# EAGLE design coaster-beer-art2_con_v.2 (EAGLE 5.04)
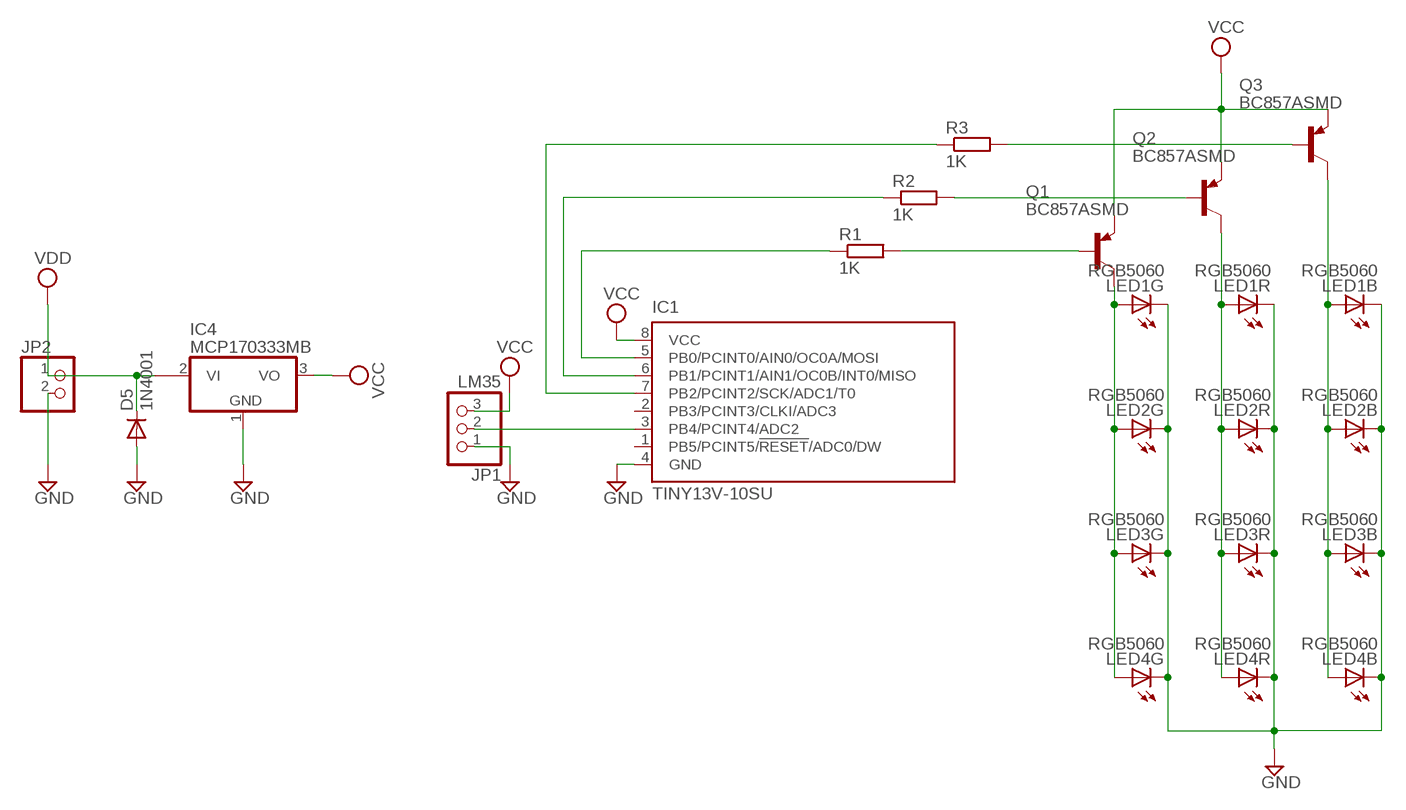
[diagram p0: schematic, sheet 1]

## Parts
D5  1N4001  DIODE-MELF-MLL41  [MELF-MLL41]
IC1  TINY13V-10SU  [8S2]
IC4  MCP170333MB  [SOT89]
JP1  LM35  PINHD-1X3  [1X03]
JP2  PINHD-1X2  [1X02]
LED1  RGB5060  LP2C63-ST-RGB-SR0  [LP2C63-ST-RGB-SR0]
LED2  RGB5060  LP2C63-ST-RGB-SR0  [LP2C63-ST-RGB-SR0]
LED3  RGB5060  LP2C63-ST-RGB-SR0  [LP2C63-ST-RGB-SR0]
LED4  RGB5060  LP2C63-ST-RGB-SR0  [LP2C63-ST-RGB-SR0]
Q1  BC857ASMD  [SOT23-BEC]
Q2  BC857ASMD  [SOT23-BEC]
Q3  BC857ASMD  [SOT23-BEC]
R1  1K  R-EU_R0805  [R0805]
R2  1K  R-EU_R0805  [R0805]
R3  1K  R-EU_M0805  [M0805]

## Nets
GND: D5.A IC1.4(GND) IC4.1(GND) JP1.1 JP2.2 LED1.4(B:C) LED1.5(R:C) LED1.6(G:C) LED2.4(B:C) LED2.5(R:C) LED2.6(G:C) LED3.4(B:C) LED3.5(R:C) LED3.6(G:C) LED4.4(B:C) LED4.5(R:C) LED4.6(G:C)
N$2: IC1.3(PB4/PCINT4/ADC2) JP1.2
N$5: LED1.1(G:A) LED2.1(G:A) LED3.1(G:A) LED4.1(G:A) Q1.C
N$6: LED1.2(R:A) LED2.2(R:A) LED3.2(R:A) LED4.2(R:A) Q2.C
N$8: IC1.5(PB0/PCINT0/AIN0/OC0A/MOSI) R1.1
N$9: Q3.B R3.2
N$10: Q2.B R2.2
N$11: Q1.B R1.2
N$13: IC1.6(PB1/PCINT1/AIN1/OC0B/INT0/MISO) R2.1
N$14: IC1.7(PB2/PCINT2/SCK/ADC1/T0) R3.1
N$15: LED1.3(B:A) LED2.3(B:A) LED3.3(B:A) LED4.3(B:A) Q3.C
VCC: IC1.8(VCC) IC4.3(VO) JP1.3 Q1.E Q2.E Q3.E
VDD: D5.C IC4.2@1(VI1) JP2.1
Unconnected: IC1.1(PB5/PCINT5/!RESET!/ADC0/DW) IC1.2(PB3/PCINT3/CLKI/ADC3) IC4.2(VI)

## Library data of the parts
D5 = diode:DIODE-: DIODE
IC1 = atmel:TINY13: 8-bit AVR Microcontroller with 1K Bytes In-System Programmable Flash Source: http://www.atmel.com/dyn/resources/prod_documents/2535S.pdf
IC4 = linear:MCP1703*: 250 mA, 16V, Low Quiescent Current LDO Regulator Source: http://ww1.microchip.com/downloads/en/DeviceDoc/22049b.pdf
JP1 = pinhead:PINHD-1X3: PIN HEADER
JP2 = pinhead:PINHD-1X2: PIN HEADER
LED1-LED4 = led-test-chuja:LP2C63-ST-RGB-SR0: 1.5W RGB HIGH POWER LED Source: http://www.ledtech.com.tw .. LP2C63-ST-RGB-SR0.SPEC.pdf
Q1-Q3 = transistor-pnp:BC857*: PNP Transistror
R1-R3 = rcl:R-EU_: RESISTOR, European symbol

## Board
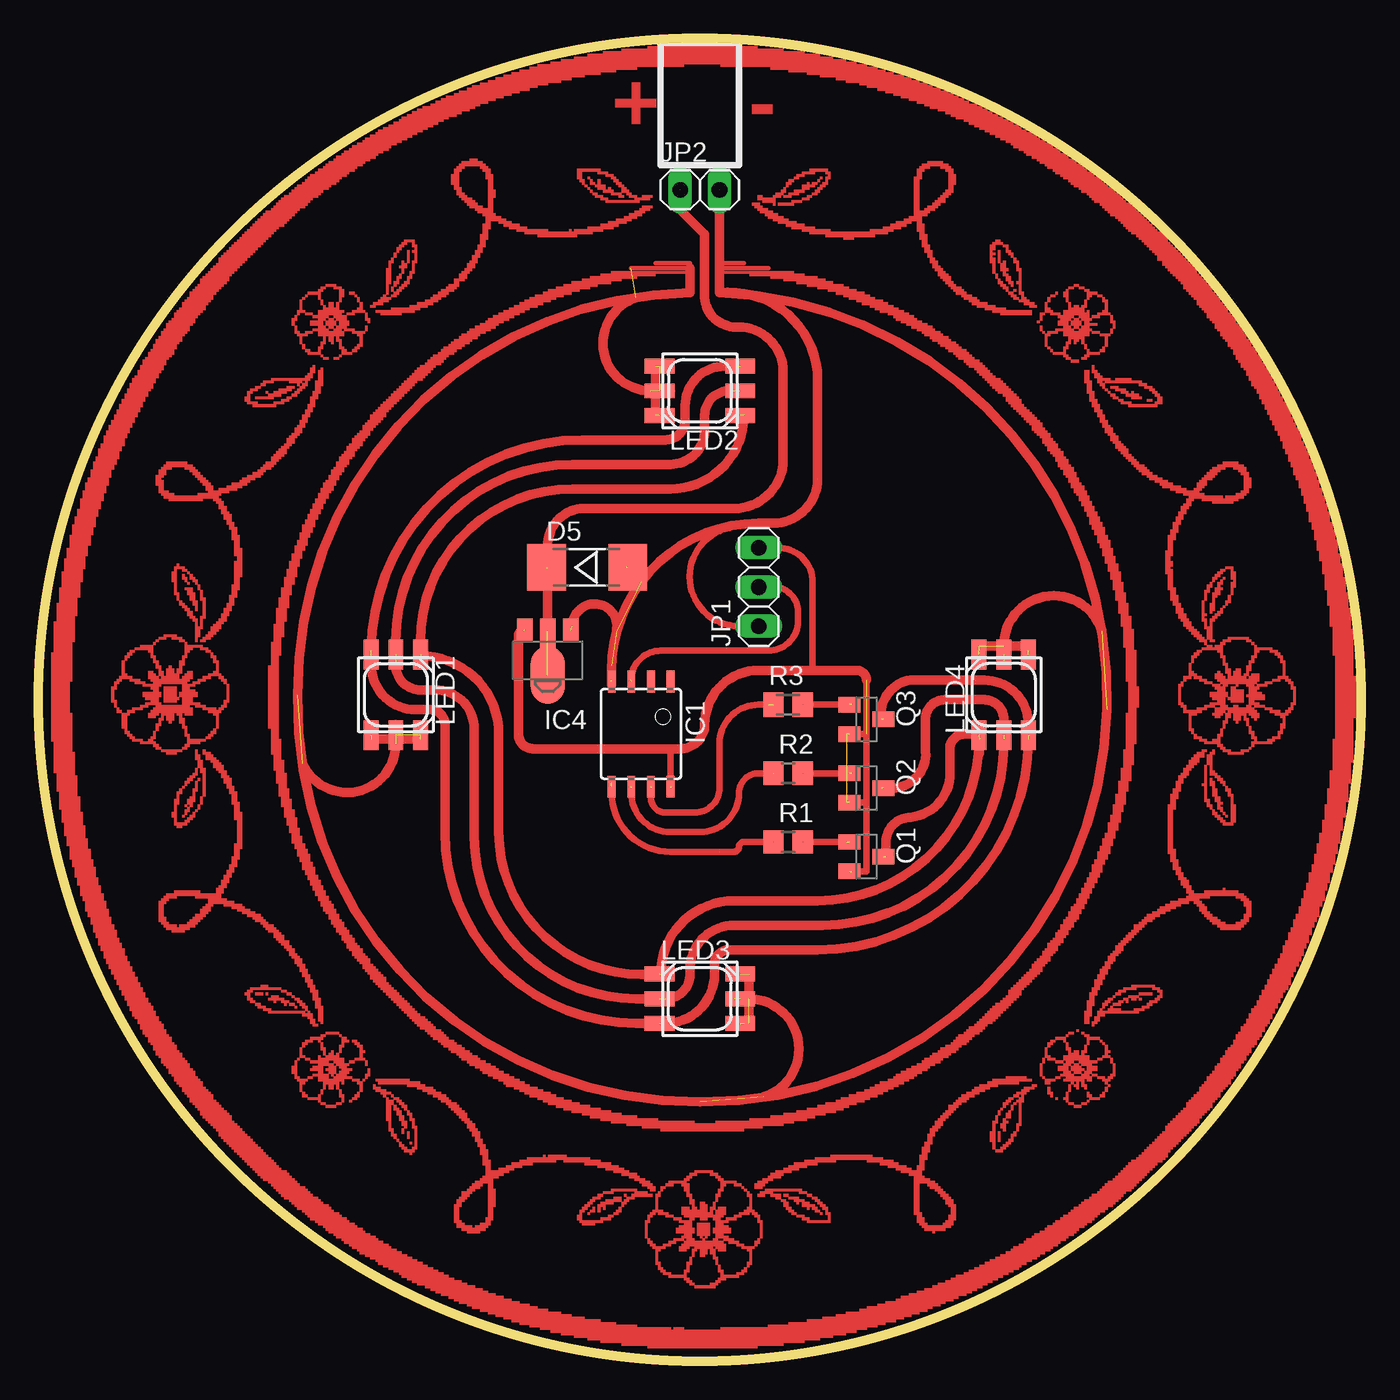
[diagram p1: board, top side]
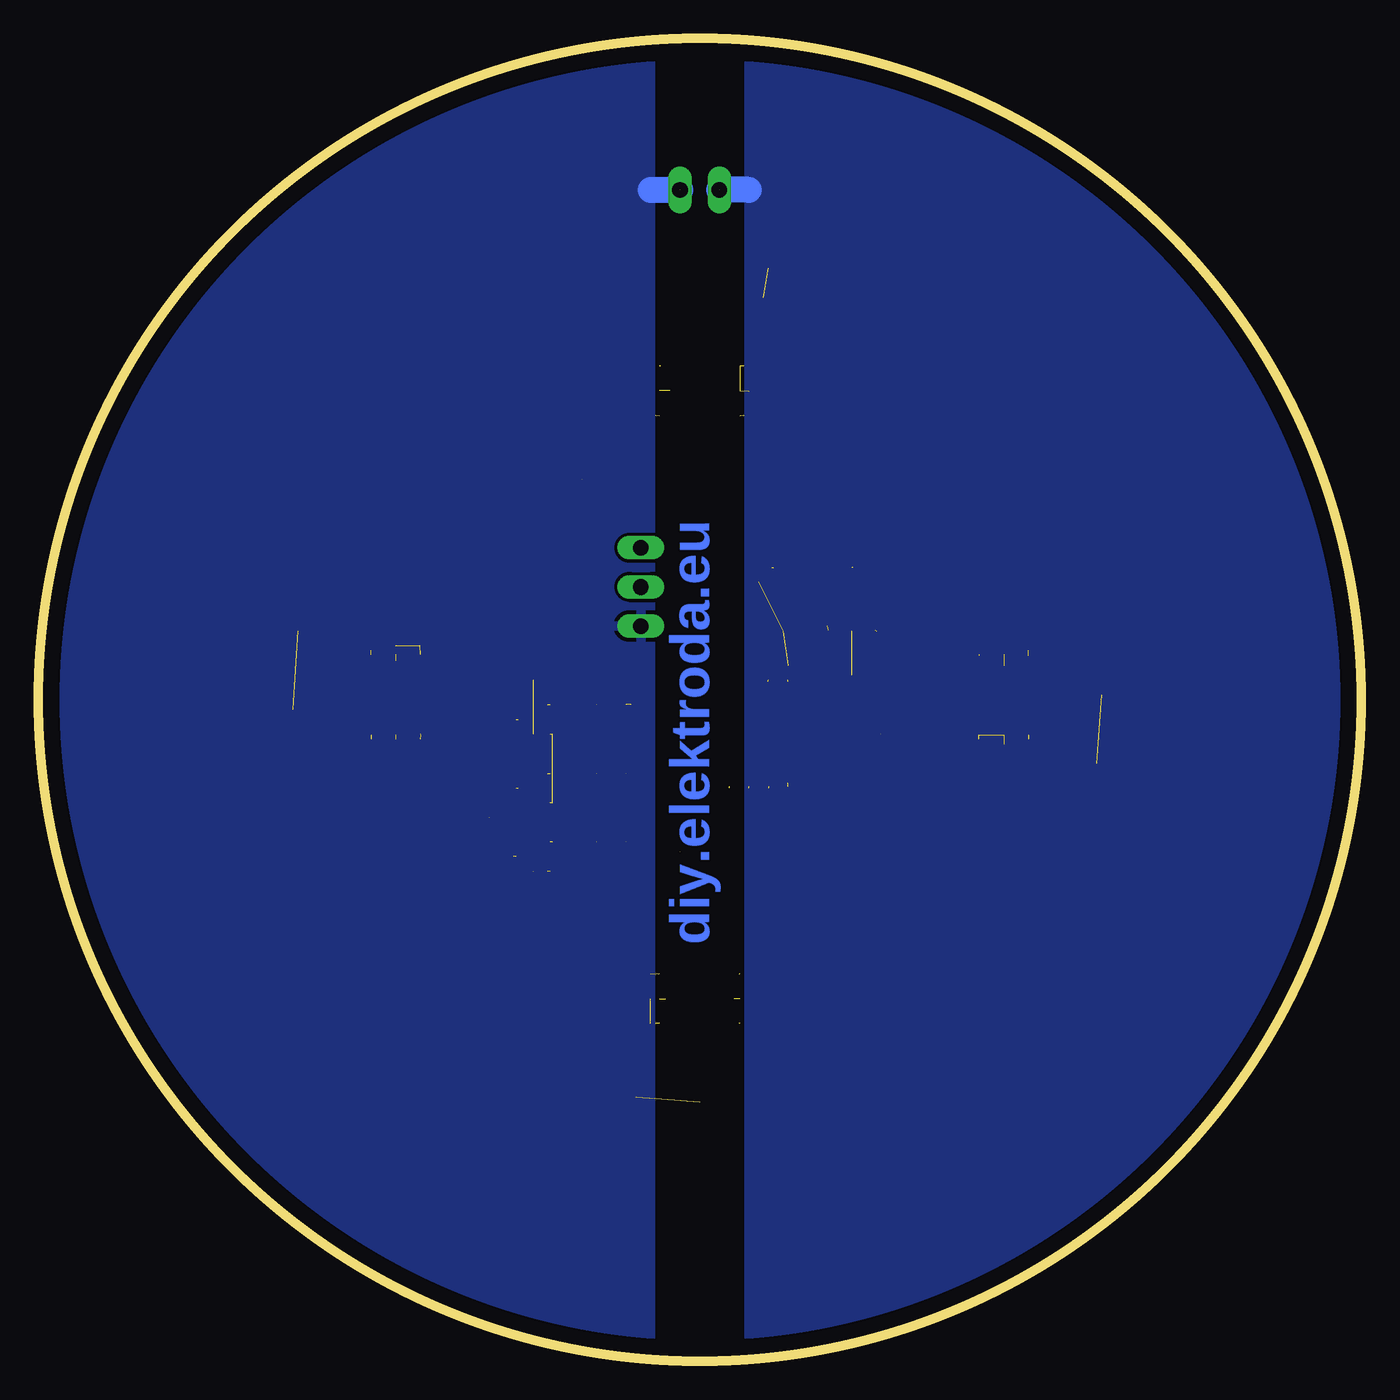
[diagram p2: board, bottom side, seen from below]

Size 85.63 x 85.63 mm. Coordinates in mm from the lower left corner, seen from the top.
Outline: circle at 42.81,42.81 radius 42.81
Copper layers (1*16): Top 0.035mm / dielectric 1.5mm / Bottom 0.035mm
Design rules "default": minimum track width 10mil, minimum drill 24mil, track to track 8mil, track to pad 8mil, pad to pad 8mil, via to via 8mil, smd to smd 8mil, copper to edge 40mil, drill to drill 8mil, minimum pad ring 10mil, minimum via ring 8mil, stop-mask expansion 4mil, vias tented up to drill 0mil, thermal gap 10mil

### Footprints (pad centres in the part's own frame; a part is rotated, then mirrored left to right if it is on the bottom)
MELF-MLL41 = smd 2.5 x 3: A 2.625,0; C -2.625,0
8S2 = smd 0.5 x 1.4: 1 -1.905,-3.404; 2 -0.645,-3.404; 3 0.625,-3.404; 4 1.895,-3.404; 5 1.905,3.404; 6 0.635,3.404; 7 -0.635,3.404; 8 -1.905,3.404
SOT89 = smd 1 x 1.5: 1 -1.499,-1.981; 3 1.499,-1.981 | smd 1 x 2: 2 0,-1.727 | smd 2.2 x 3.7: 2@1 0,0.94
1X03 = drill 1.016 long: 1 -2.54,0; 2 0,0; 3 2.54,0
1X02 = drill 1.016 long: 1 -1.27,0; 2 1.27,0
LP2C63-ST-RGB-SR0 = smd 1.93 x 0.965: 1 -2.615,1.6; 2 -2.615,0; 3 -2.615,-1.6; 4 2.615,-1.6; 5 2.615,0; 6 2.615,1.6 | smd 0.305 x 0.152: TH -2.54,0
SOT23-BEC = smd 1 x 1.4: B -0.95,-1.1; C 0,1.1; E 0.95,-1.1
R0805 = smd 1.3 x 1.5: 1 -0.95,0; 2 0.95,0
M0805 = smd 1.3 x 1.6: 1 -0.95,0; 2 0.95,0

### Placement (x,y rotation side)
D5  35.52,51.39 0 top
IC1  39.01,40.59 180 top
IC4  32.97,45.35 180 top
JP1  46.63,50.12 90 top
JP2  42.82,75.84 0 top
LED1  23.13,43.13 270 top
LED2  42.82,62.82 180 top
LED3  42.82,23.45 0 top
LED4  62.5,43.13 90 top
Q1  53.61,32.65 270 top
Q2  53.61,37.1 270 top
Q3  53.61,41.54 270 top
R1  48.53,33.61 0 top
R2  48.53,38.05 0 top
R3  48.53,42.5 0 top

### Tracks (layer width: path | path; a pad name or v marks a point on that pad's centre or on a via)
GND  (29 unrouted)
  Top 0.305: 42.18,70.75 38.37,70.75
  Top 0.406: JP1.1 45.36,47.58 arc-169 44.72,53.93
  Top 0.61: 37.1,44.4 37.1,44.09 | 37.1,44.4 37.1,45.04 | 37.1,43.77 37.1,44.4 | 37.1,44.4 37.1,44.72 arc-90 46.63,54.25 47.58,54.25 arc90 50.44,57.1 | 44.08,69.17 arc-90 69.17,42.18 arc-89 42.81,16.78 arc-92 16.78,43.13 arc-90 42.18,69.17 42.18,70.75 | 45.99,25.04 45.99,21.86 45.68,21.86 | 21.55,40.28 24.72,40.28 | 39.96,61.23 39.96,64.41 | 60.92,46.31 64.09,46.31 64.09,45.99 | 44.08,69.17 JP2.2 | 40.91,62.82 39.64,62.82 arc-162 38.69,68.85 | 62.5,45.35 62.5,46.31 arc-163 68.85,47.26 | 23.13,41.23 23.13,39.96 arc-156 17.1,38.69 | 45.04,23.45 45.99,23.45 arc-163 46.94,17.1 | 50.43,57.1 50.43,64.09 arc90 44.08,69.17 | 37.1,44.08 37.1,45.04 | 34.56,46.94 34.56,47.58 arc-193 37.42,47.26 | 38.05,51.39 39,50.43
  Bottom 1.676: 45.99,75.83 JP2.2
  pour Bottom: 45.99,85.99 45.99,-1 85.99,-1 85.99,85.99
  pour Bottom: 45.99,45.67 arc180 49.48,45.67
N$2  (1 unrouted)
  Top 0.406: 38.37,44.09 arc-90 40.28,45.99 47.26,45.99 arc90 49.17,47.9 49.17,48.53 arc90 47.58,50.12 JP1.2
N$3
  Top 0.305: 44.08,70.75 47.26,70.75
N$4
  Top 0.305: 39.96,71.07 42.18,71.07
N$5  (7 unrouted)
  Top 0.61: 60.92,39.32 60.92,40.28 arc-90 50.44,29.8 45.04,29.8 arc90 40.28,25.04 39.01,25.04 arc-90 29.8,34.24 29.8,40.59 arc90 24.72,45.67 24.72,46.63 arc-90 34.56,56.47 40.91,56.47 arc90 45.68,61.23 | 56.47,35.2 arc90 59.01,38.37 59.01,39.64 arc-90 59.96,40.59 60.92,40.59 | 56.47,35.19 arc90 54.88,33.61 54.88,32.65
N$6  (5 unrouted)
  Top 0.61: 62.5,39.96 62.5,40.28 | 62.5,39.96 arc-90 50.76,28.21 45.04,28.21 arc90 42.18,25.35 42.18,25.04 arc-90 40.6,23.45 38.69,23.45 arc-90 28.21,33.93 28.21,40.91 arc90 25.67,43.45 24.72,43.45 arc-90 23.13,45.04 23.13,46.63 arc-90 34.56,58.06 40.91,58.06 arc90 43.14,60.28 43.14,61.23 arc-90 44.72,62.82 | 54.57,37.1 55.52,37.1 arc90 57.42,39.64 57.42,41.55 arc-90 58.69,42.82 61.23,42.82 arc-90 62.5,41.55 62.5,39.96
N$7
  Top 0.305: 44.08,71.07 45.67,71.07
N$8  (3 unrouted)
  Top 0.406: 44.09,32.97 40.91,32.97 arc-90 37.1,36.78 37.1,37.42 | 44.08,32.97 45.04,32.97 arc90 45.35,33.29 arc-90 45.67,33.61 R1.1
N$9  (2 unrouted)
  Top 0.406: R3.2 52.66,42.5
N$10  (2 unrouted)
  Top 0.406: R2.2 52.66,38.05
N$11  (2 unrouted)
  Top 0.406: R1.2 52.34,33.61
N$13  (2 unrouted)
  Top 0.406: 38.37,37.1 38.37,36.78 arc90 40.91,34.24 42.82,34.24 arc90 45.36,36.78 arc-90 46.63,38.05 R2.1
N$14  (2 unrouted)
  Top 0.406: 47.26,42.5 46.63,42.5 arc90 44.09,39.96 44.09,37.1 arc-90 42.5,35.51 40.6,35.51 arc-90 39.64,36.47 39.64,37.1
N$15  (6 unrouted)
  Top 0.61: 21.55,45.67 21.55,45.04 arc90 24.4,42.18 25.36,42.18 arc-90 26.31,41.23 26.31,34.24 arc90 38.69,21.86 40.28,21.86 40.6,21.86 arc90 43.77,25.04 43.77,25.67 arc-90 44.72,26.62 50.44,26.62 arc90 64.09,40.28 64.09,41.23 arc90 61.23,44.09 56.47,44.09 arc90 54.57,41.55 | 21.55,45.99 arc-90 35.2,59.64 40.6,59.64 arc90 41.87,60.91 41.87,61.87 arc-90 44.41,64.41 45.36,64.41
VCC  (9 unrouted)
  Top 0.406: 53.61,44.4 53.61,44.09 53.61,31.7 | 40.91,39.64 40.91,37.1 | JP1.3 47.9,52.66 arc-90 50.12,50.44 50.12,44.72 | 53.61,31.7 52.66,31.7 | 52.34,36.15 53.61,36.15 | 53.61,40.59 52.34,40.59
  Top 0.61: 31.07,40.59 arc90 32.02,39.64 40.91,39.64 41.55,39.64 arc90 43.14,41.23 arc-90 46.63,44.72 50.12,44.72 52.98,44.72 arc-90 53.61,44.09 | 31.07,40.59 31.07,46.94 arc-90 31.38,47.26
VDD  (4 unrouted)
  Top 0.61: JP2.1 41.54,74.56 43.13,72.98 43.13,68.85 arc90 45.35,66.94 arc-90 48.21,64.09 48.21,58.37 arc-90 45.04,55.2 35.51,55.2 arc90 32.97,52.97 32.97,51.39 32.97,47.26
  Bottom 1.676: 39.64,75.83 JP2.1
  pour Bottom: 39.64,85.99 39.64,-1 -0.37,-1 -0.37,78.37 -0.37,85.99
(copper drawn outside any net)
  shapes: Top area x4326

### Text on the board
Top: + | -
Bottom: diy.elektroda.eu